# Altium project ADIS16488.PrjPcb
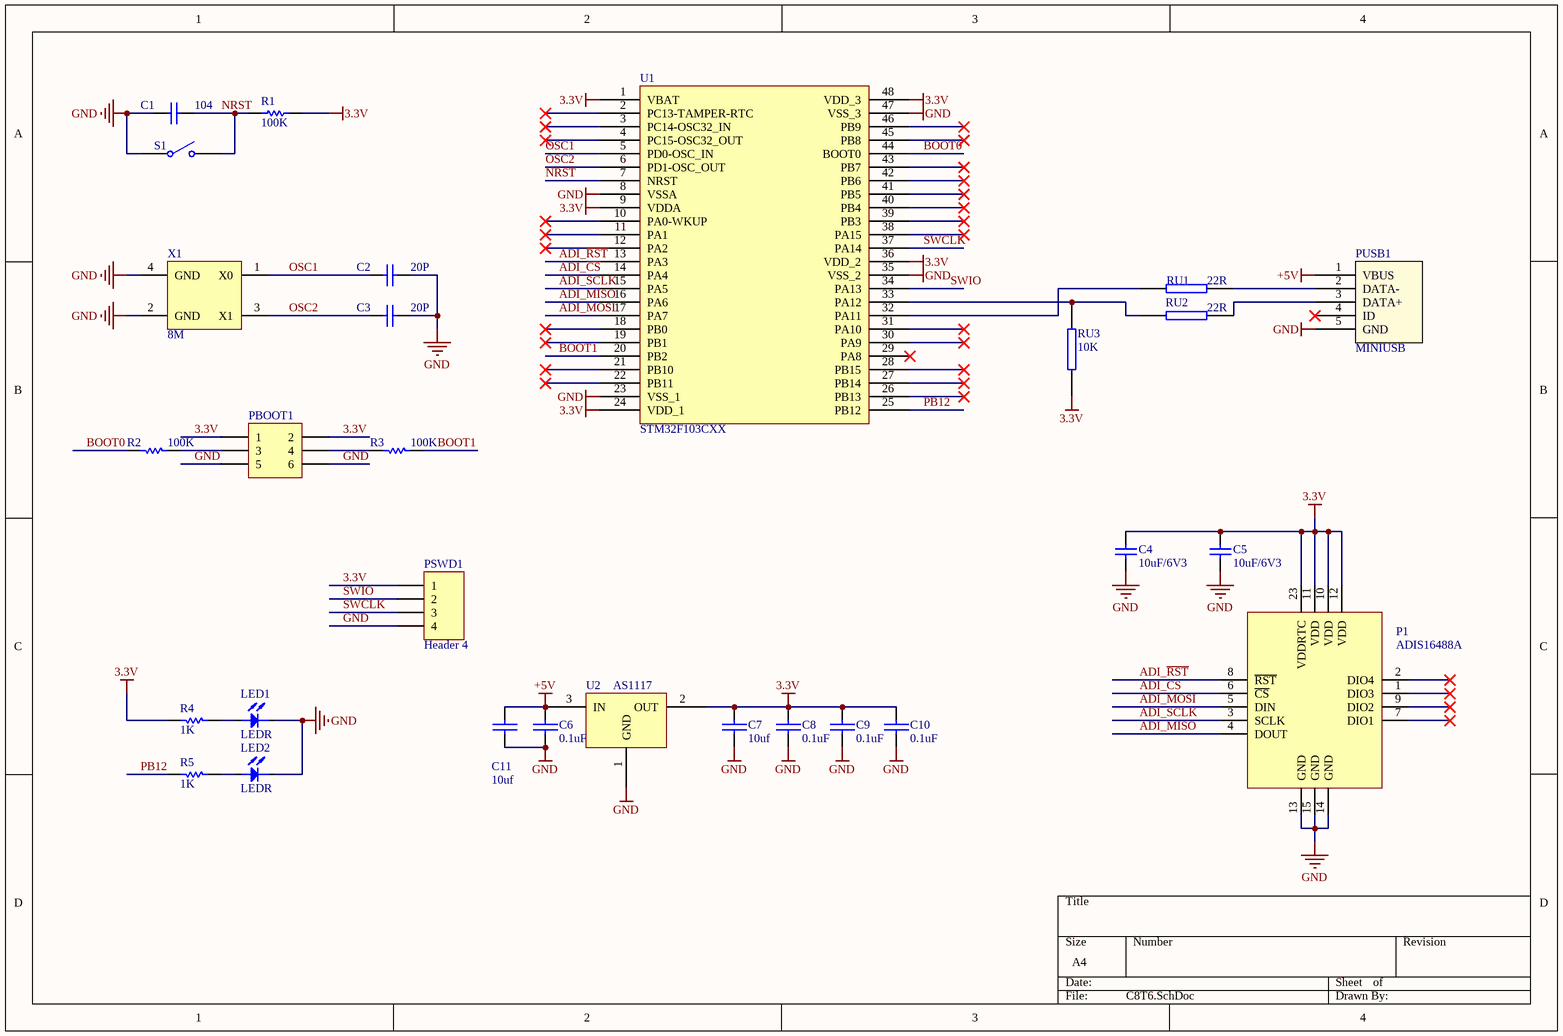
[diagram p0: C8T6.SchDoc]
1 sheet, 29 parts. Net scope: global (net labels, ports and power ports of the same name join across sheets).
Board file: stm32_adis.PcbDoc

## Sheet C8T6.SchDoc
size A4

### Parts
C1  104  [0805_C]
C2  20P  [0805_C]
C3  20P  [0805_C]
C4  10uF/6V3  [0805_C]
C5  10uF/6V3  [0805_C]
C6  0.1uF  [0805_C]
C7  10uf  [0805_C]
C8  0.1uF  [0805_C]
C9  0.1uF  [0805_C]
C10  0.1uF  [0805_C]
C11  10uf  [0805_C]
LED1  LEDR  [0805_R]
LED2  LEDR  [0805_R]
P1  ADIS16488A  [ADIS16488A]
PBOOT1  Header 3X2  [HDR2X3]  (value not drawn)
PSWD1  Header 4  [HDR1X4]
PUSB1  MINIUSB  [USB_Micro]
R1  100K  [0805_R]
R2  100K  [0805_R]
R3  100K  [0805_R]
R4  1K  [0805_R]
R5  1K  [0805_R]
RU1  22R  [0805_R]
RU2  22R  [0805_R]
RU3  10K  [0805_R]
S1  SW-SPST  [KEY_SMT]  (value not drawn)
U1  STM32F103CXX  [LQFP-48_7x7x05P]
U2  AS1117  [SOT-223]
X1  8M  [3225-XTAL]

### Nets
3.3V: C4.2 C5.2 C7.1 C8.1 C9.1 C10.1 P1.10(VDD) P1.11(VDD) P1.12(VDD) P1.23(VDDRTC) PBOOT1.1 PBOOT1.2 PSWD1.1 R1.2 R4.2 RU3.1 U1.1(VBAT) U1.9(VDDA) U1.24(VDD_1) U1.36(VDD_2) U1.48(VDD_3) U2.2(OUT)
+5V: C6.1 C11.1 PUSB1.1(VBUS) U2.3(IN)
GND: C1.1 C2.2 C3.2 C4.1 C5.1 C6.2 C7.2 C8.2 C9.2 C10.2 C11.2 LED1.2 LED2.2 P1.13(GND) P1.14(GND) P1.15(GND) PBOOT1.5 PBOOT1.6 PSWD1.4 PUSB1.5(GND) S1.1(COMMON) U1.8(VSSA) U1.23(VSS_1) U1.35(VSS_2) U1.47(VSS_3) U2.1(GND) X1.2(GND) X1.4(GND)
ADI_~{CS}: P1.6(~{CS}) U1.14(PA4)
ADI_MISO: P1.4(DOUT) U1.16(PA6)
ADI_MOSI: P1.5(DIN) U1.17(PA7)
ADI_~{RST}: P1.8(~{RST}) U1.13(PA3)
ADI_SCLK: P1.3(SCLK) U1.15(PA5)
BOOT0: R2.2 U1.44(BOOT0)
BOOT1: R3.1 U1.20(PB2)
NRST: C1.2 R1.1 S1.2(NO) U1.7(NRST)
OSC1: C2.1 U1.5(PD0-OSC_IN) X1.1(X0)
OSC2: C3.1 U1.6(PD1-OSC_OUT) X1.3(X1)
PB12: R5.2 U1.25(PB12)
SWCLK: PSWD1.3 U1.37(PA14)
SWIO: PSWD1.2 U1.34(PA13)
NetLED1_1: LED1.1 R4.1
NetLED2_1: LED2.1 R5.1
NetPBOOT1_3: PBOOT1.3 R2.1
NetPBOOT1_4: PBOOT1.4 R3.2
NetPUSB1_2: PUSB1.2(DATA-) RU1.2
NetPUSB1_3: PUSB1.3(DATA+) RU2.2
NetRU1_1: RU1.1 U1.32(PA11)
NetRU2_1: RU2.1 RU3.2 U1.33(PA12)

Not connected (* = marked no-connect by the designer): P1 1(DIO3)* 2(DIO4)* 7(DIO1)* 9(DIO2)*; PUSB1 4(ID)*; U1 2(PC13-TAMPER-RTC)* 3(PC14-OSC32_IN)* 4(PC15-OSC32_OUT)* 10(PA0-WKUP)* 11(PA1)* 12(PA2)* 18(PB0)* 19(PB1)* 21(PB10)* 22(PB11)* 26(PB13)* 27(PB14)* 28(PB15)* 29(PA8)* 30(PA9)* 31(PA10)* 38(PA15)* 39(PB3)* 40(PB4)* 41(PB5)* 42(PB6)* 43(PB7)* 45(PB8)* 46(PB9)*

### Library data of the parts
C1-C3 = Cap Cer: Ceramic Capacitor; Value: 476; Published: 8-Jun-2000; LatestRevisionDate: 17-Jul-2002; LatestRevisionNote: Re-released for DXP Platform.; PackageReference: C1206; Publisher: Altium Limited
C4 C5 = Cap Cer: Ceramic Capacitor; Value: 10uF/16V; Published: 8-Jun-2000; LatestRevisionDate: 17-Jul-2002; LatestRevisionNote: Re-released for DXP Platform.; PackageReference: C1206; Publisher: Altium Limited
C6-C11 = CAP: Capacitor
LED1 LED2 = LED
P1 = ADIS16488A: Header, 12-Pin, Dual row; LatestRevisionDate: 17-Jul-2002; LatestRevisionNote: Re-released for DXP Platform.; Publisher: Altium Limited
PBOOT1 = Header 3X2: Header, 3-Pin, Dual row; LatestRevisionDate: 17-Jul-2002; LatestRevisionNote: Re-released for DXP Platform.; Publisher: Altium Limited
PSWD1 = Header 4: Header, 4-Pin; LatestRevisionDate: 17-Jul-2002; LatestRevisionNote: Re-released for DXP Platform.; Publisher: Altium Limited
R1-R3 = Res: Resistor; Value: 1K; Published: 8-Jun-2000; LatestRevisionDate: 17-Jul-2002; LatestRevisionNote: Re-released for DXP Platform.; Publisher: Altium Limited
R4 R5 = Res: Resistor; Published: 8-Jun-2000; LatestRevisionDate: 17-Jul-2002; LatestRevisionNote: Re-released for DXP Platform.; Publisher: Altium Limited; Value: 1K
RU1-RU3 = RES2
S1 = SW-SPST: Single-Pole, Single-Throw Switch; Published: 24-Mar-1999; LatestRevisionDate: 17-Jul-2002; LatestRevisionNote: Re-released for DXP Platform.; PackageReference: SPST-2; Publisher: Altium Limited; PackageDescription: Switch; 2 Leads
X1 = Crystal: Value: 8M